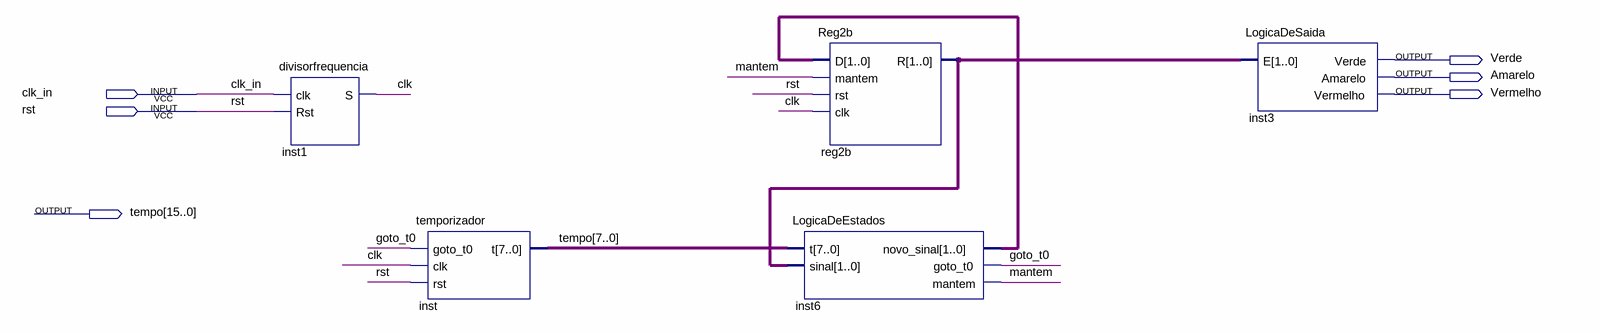
[diagram p0: schematic sheet]
// Quartus schematic lab10.bdf as structural Verilog: 5 symbols, 6 pins
module lab10 (
  input  clk_in,
  input  rst,
  output Verde,
  output Amarelo,
  output Vermelho,
  output [15:0] tempo
);

  wire clk, goto_t0, mantem;
  wire [1:0] inst6_novo_sinal, reg2b_r;

  divisorfrequencia inst1 (.clk(clk_in), .Rst(rst), .S(clk));
  temporizador inst (.goto_t0(goto_t0), .clk(clk), .rst(rst), .t(tempo[7:0]));
  LogicaDeEstados inst6 (
    .t(tempo[7:0]), .sinal(reg2b_r), .novo_sinal(inst6_novo_sinal), .goto_t0(goto_t0), .mantem(mantem));
  Reg2b reg2b (.D(inst6_novo_sinal), .mantem(mantem), .rst(rst), .clk(clk), .R(reg2b_r));
  LogicaDeSaida inst3 (.E(reg2b_r), .Verde(Verde), .Amarelo(Amarelo), .Vermelho(Vermelho));
endmodule
